# Altium schematic sheet ETH_SWITCH.SchDoc
size 594 x 420 mm; PageSetup: Record=PageOptions|CenterHorizontal=True|CenterVertical=True|PrintScale=0.94|XCorrection=1.00|YCorrection=1.00|PrintKind=1|BorderSize=5000000|LeftOffset=0|BottomOffset=0|Orientation=1|PaperLength=1000|PaperWidth=1000|Scale=100|PaperSource=7|PrintQuality=-4|MediaType=1|DitherType=10|PaperKind=A4|PrintScaleMode=1; Address1: Address1; Address2: Address2; Address3: Address3; Address4: Address4; DocumentNumber: 3; SheetNumber: 3; SheetTotal: 5
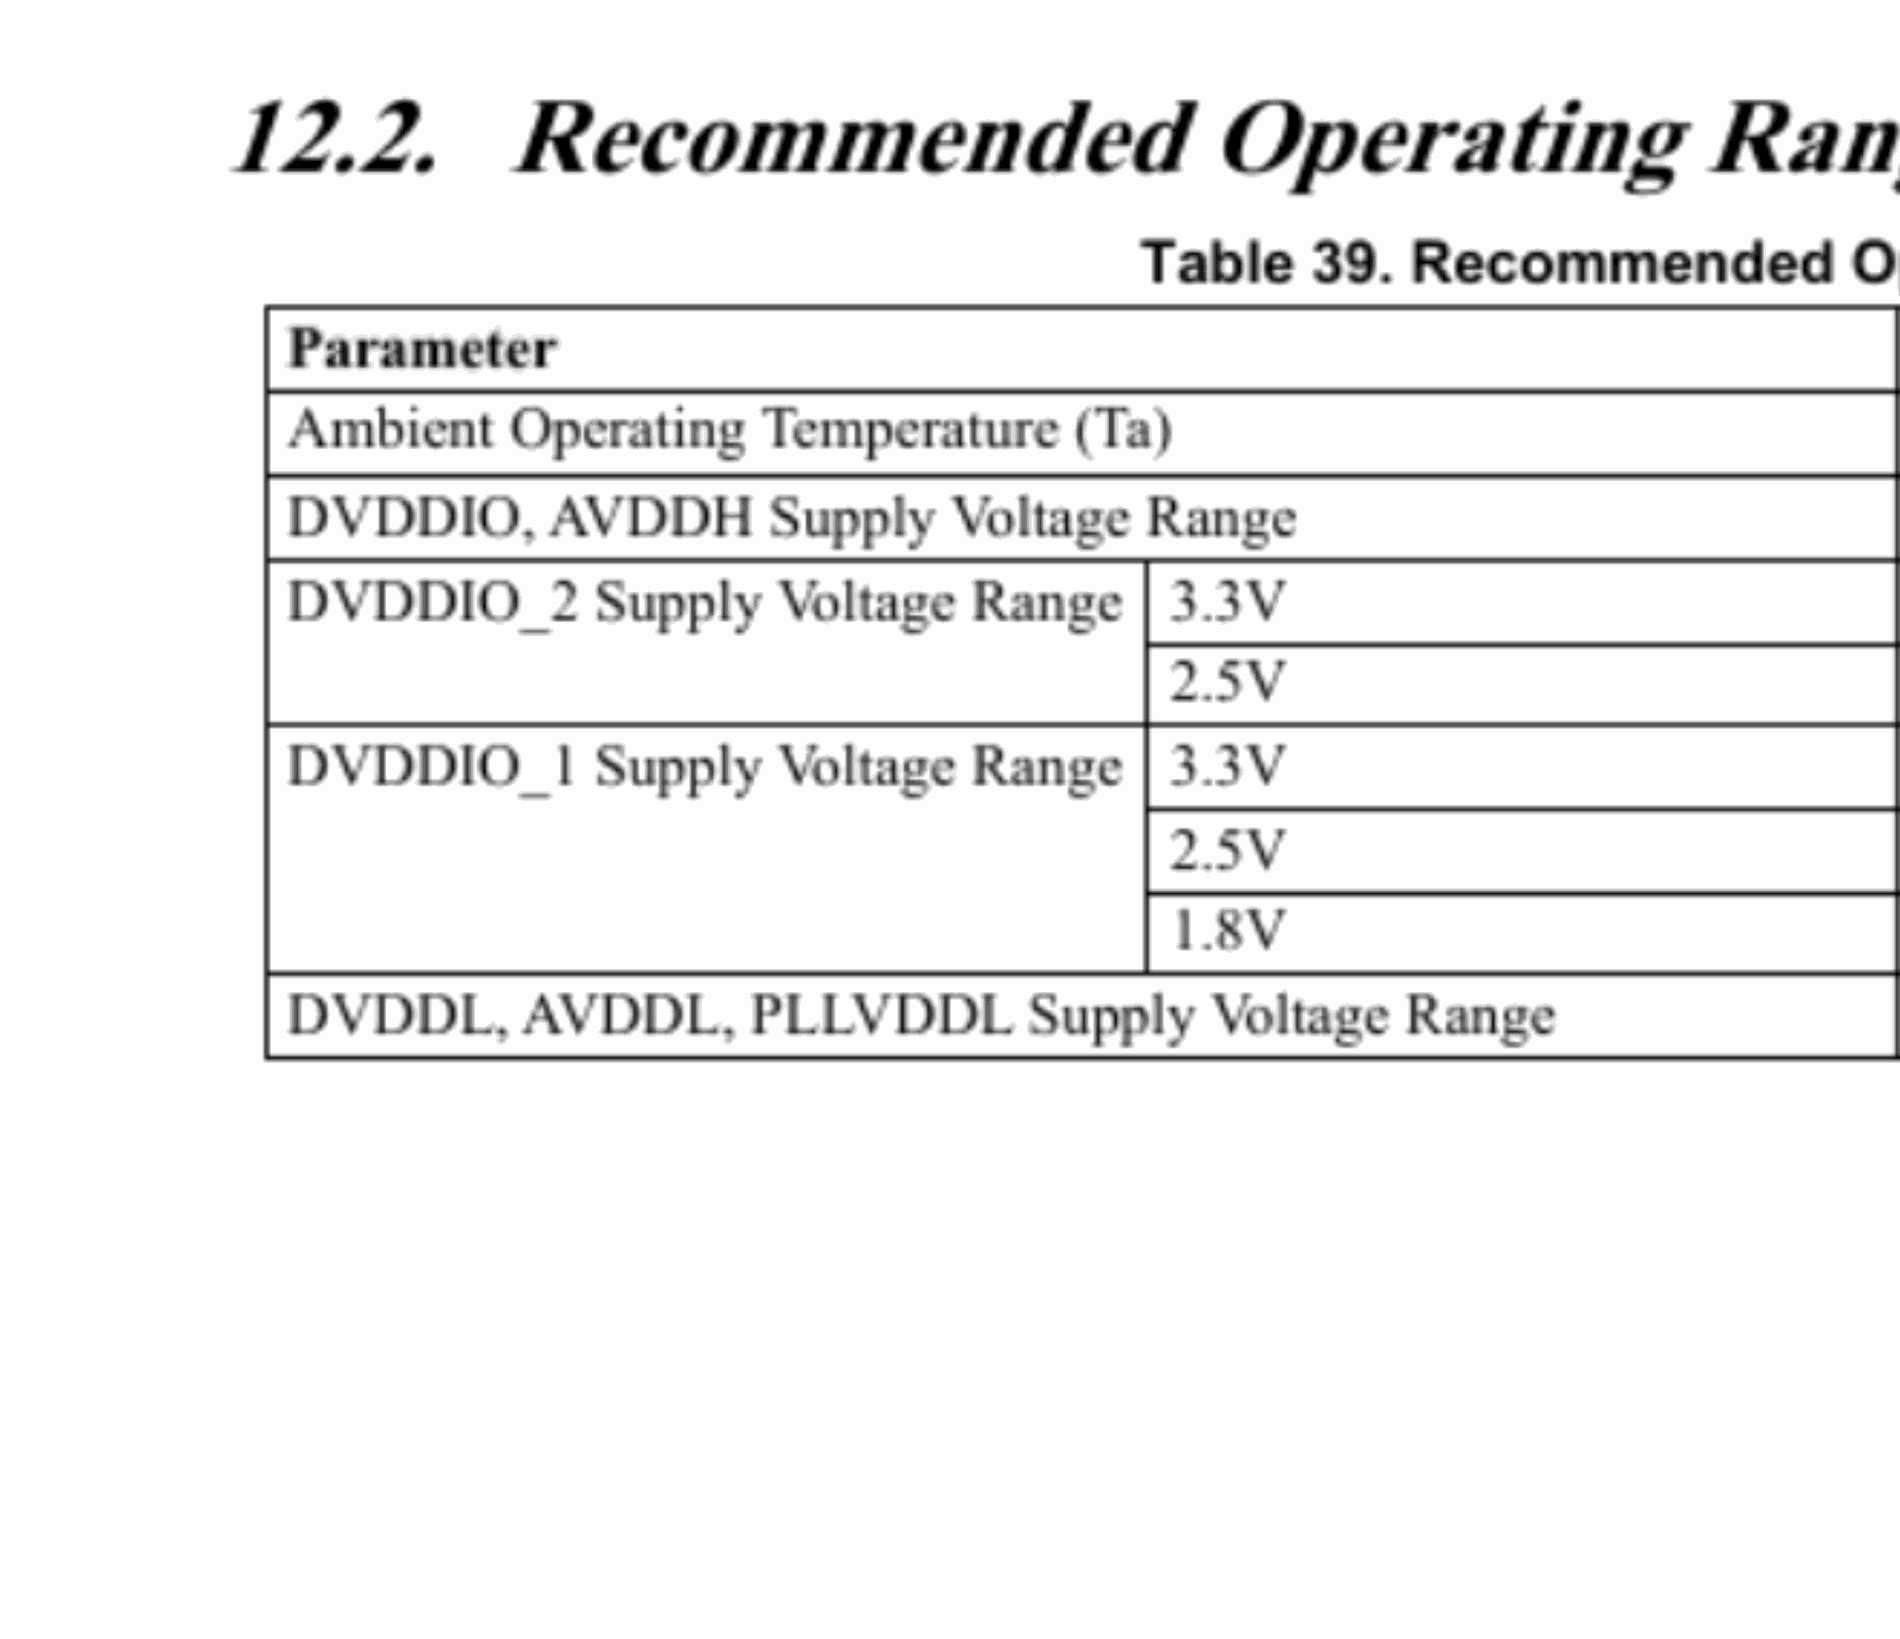
[diagram p0: ETH_SWITCH.SchDoc, top left]
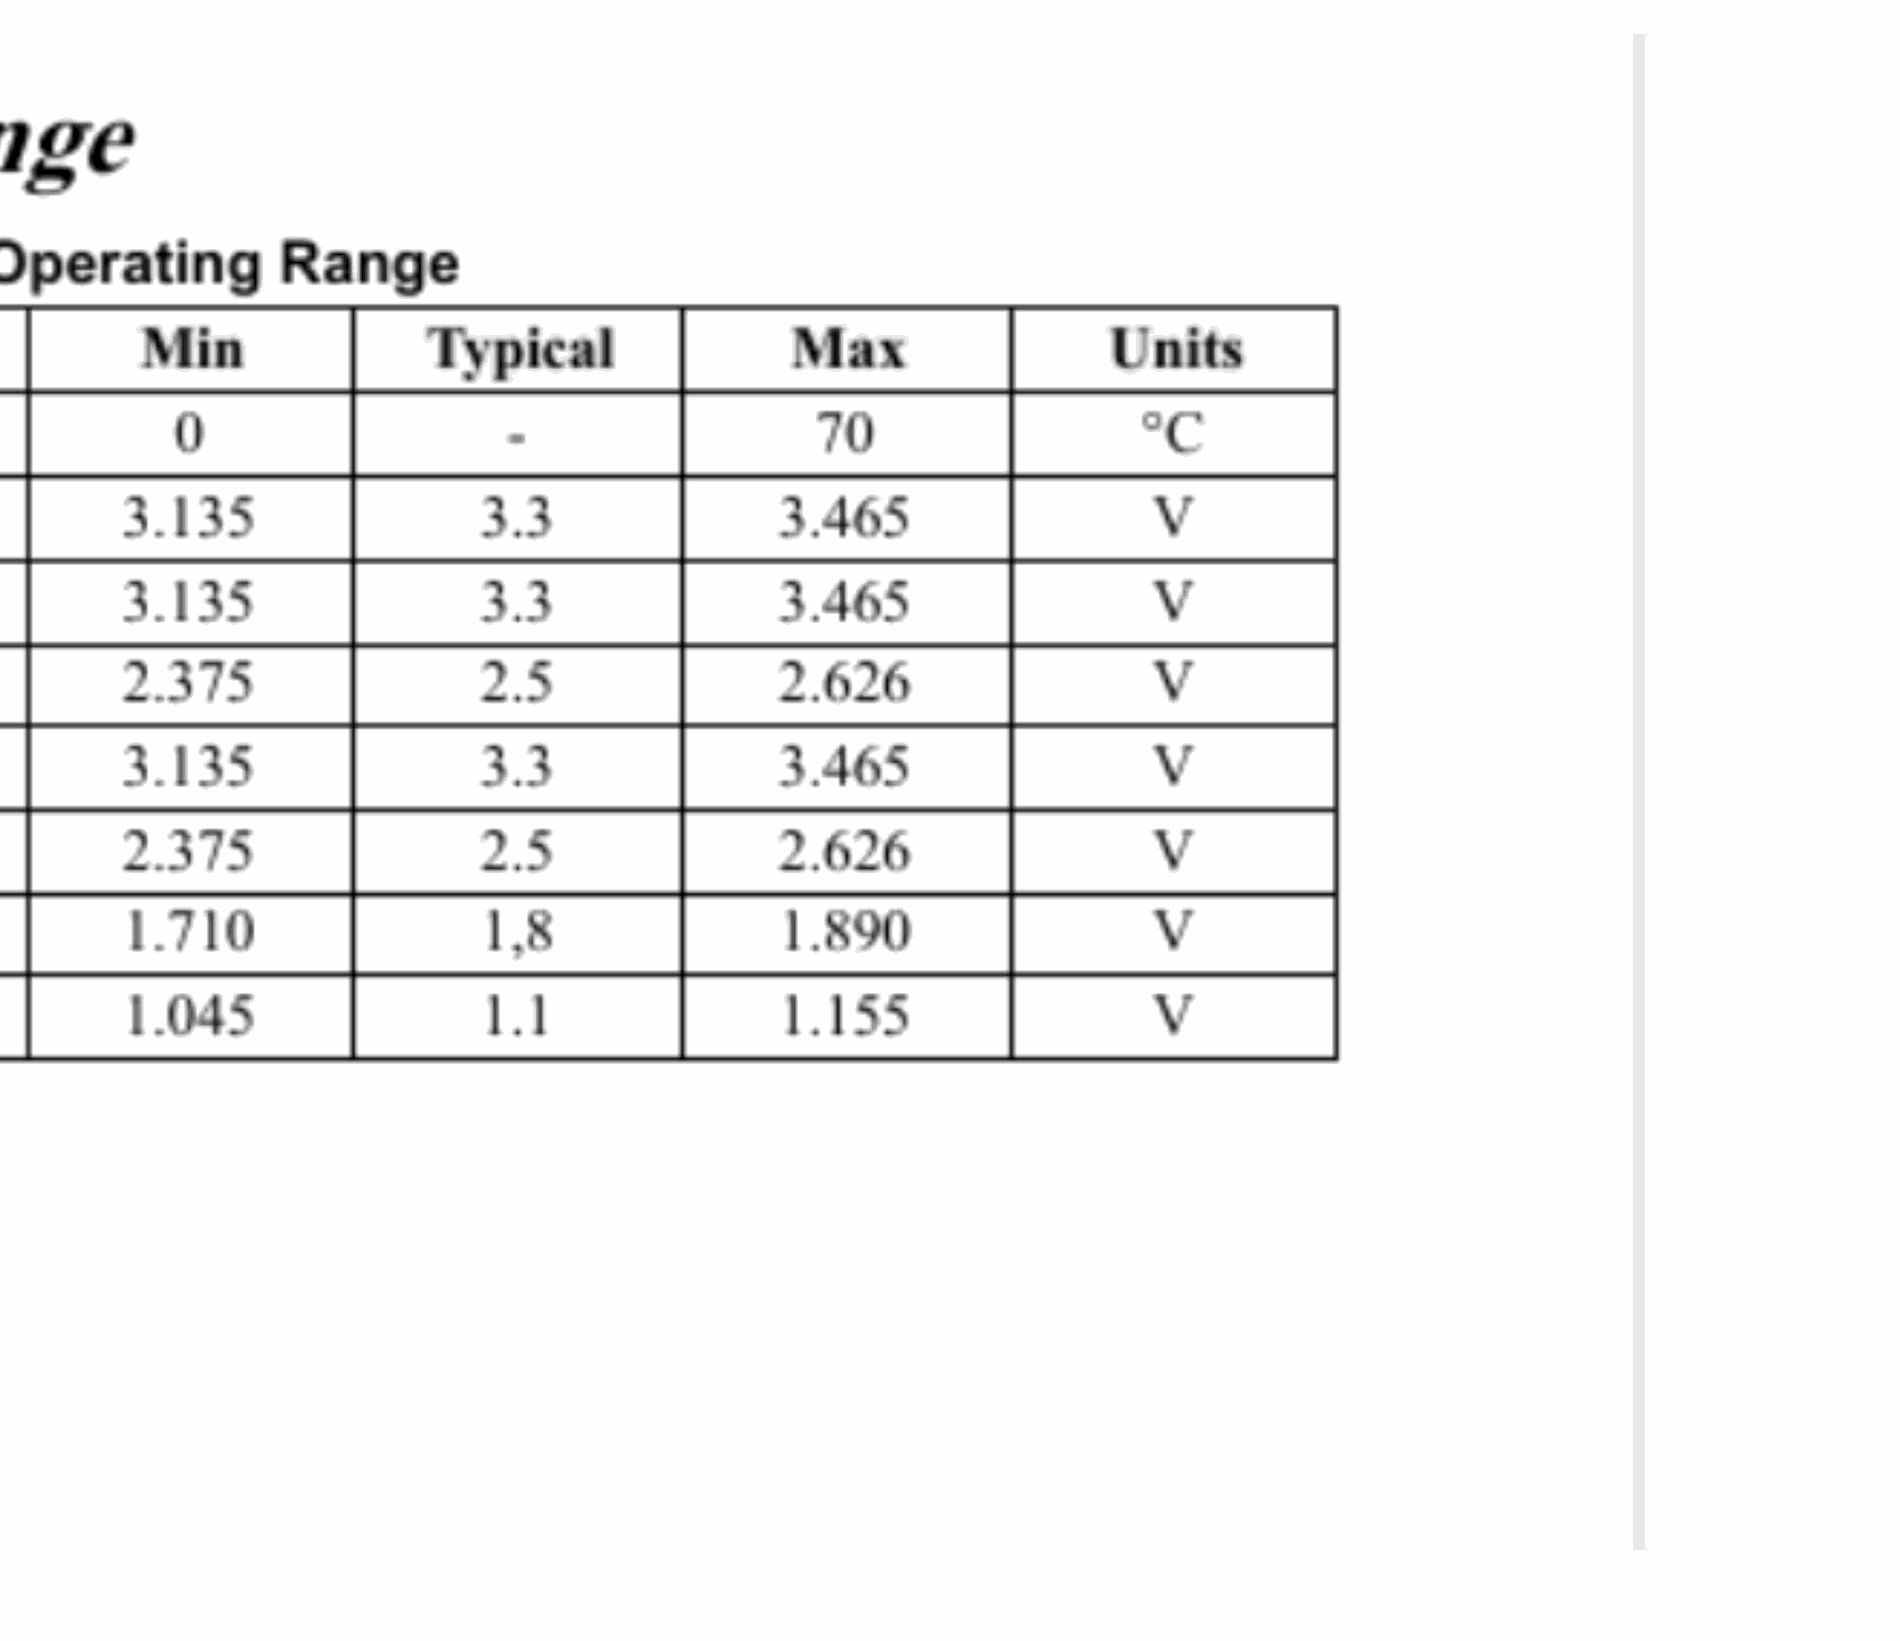
[diagram p1: ETH_SWITCH.SchDoc, top right]
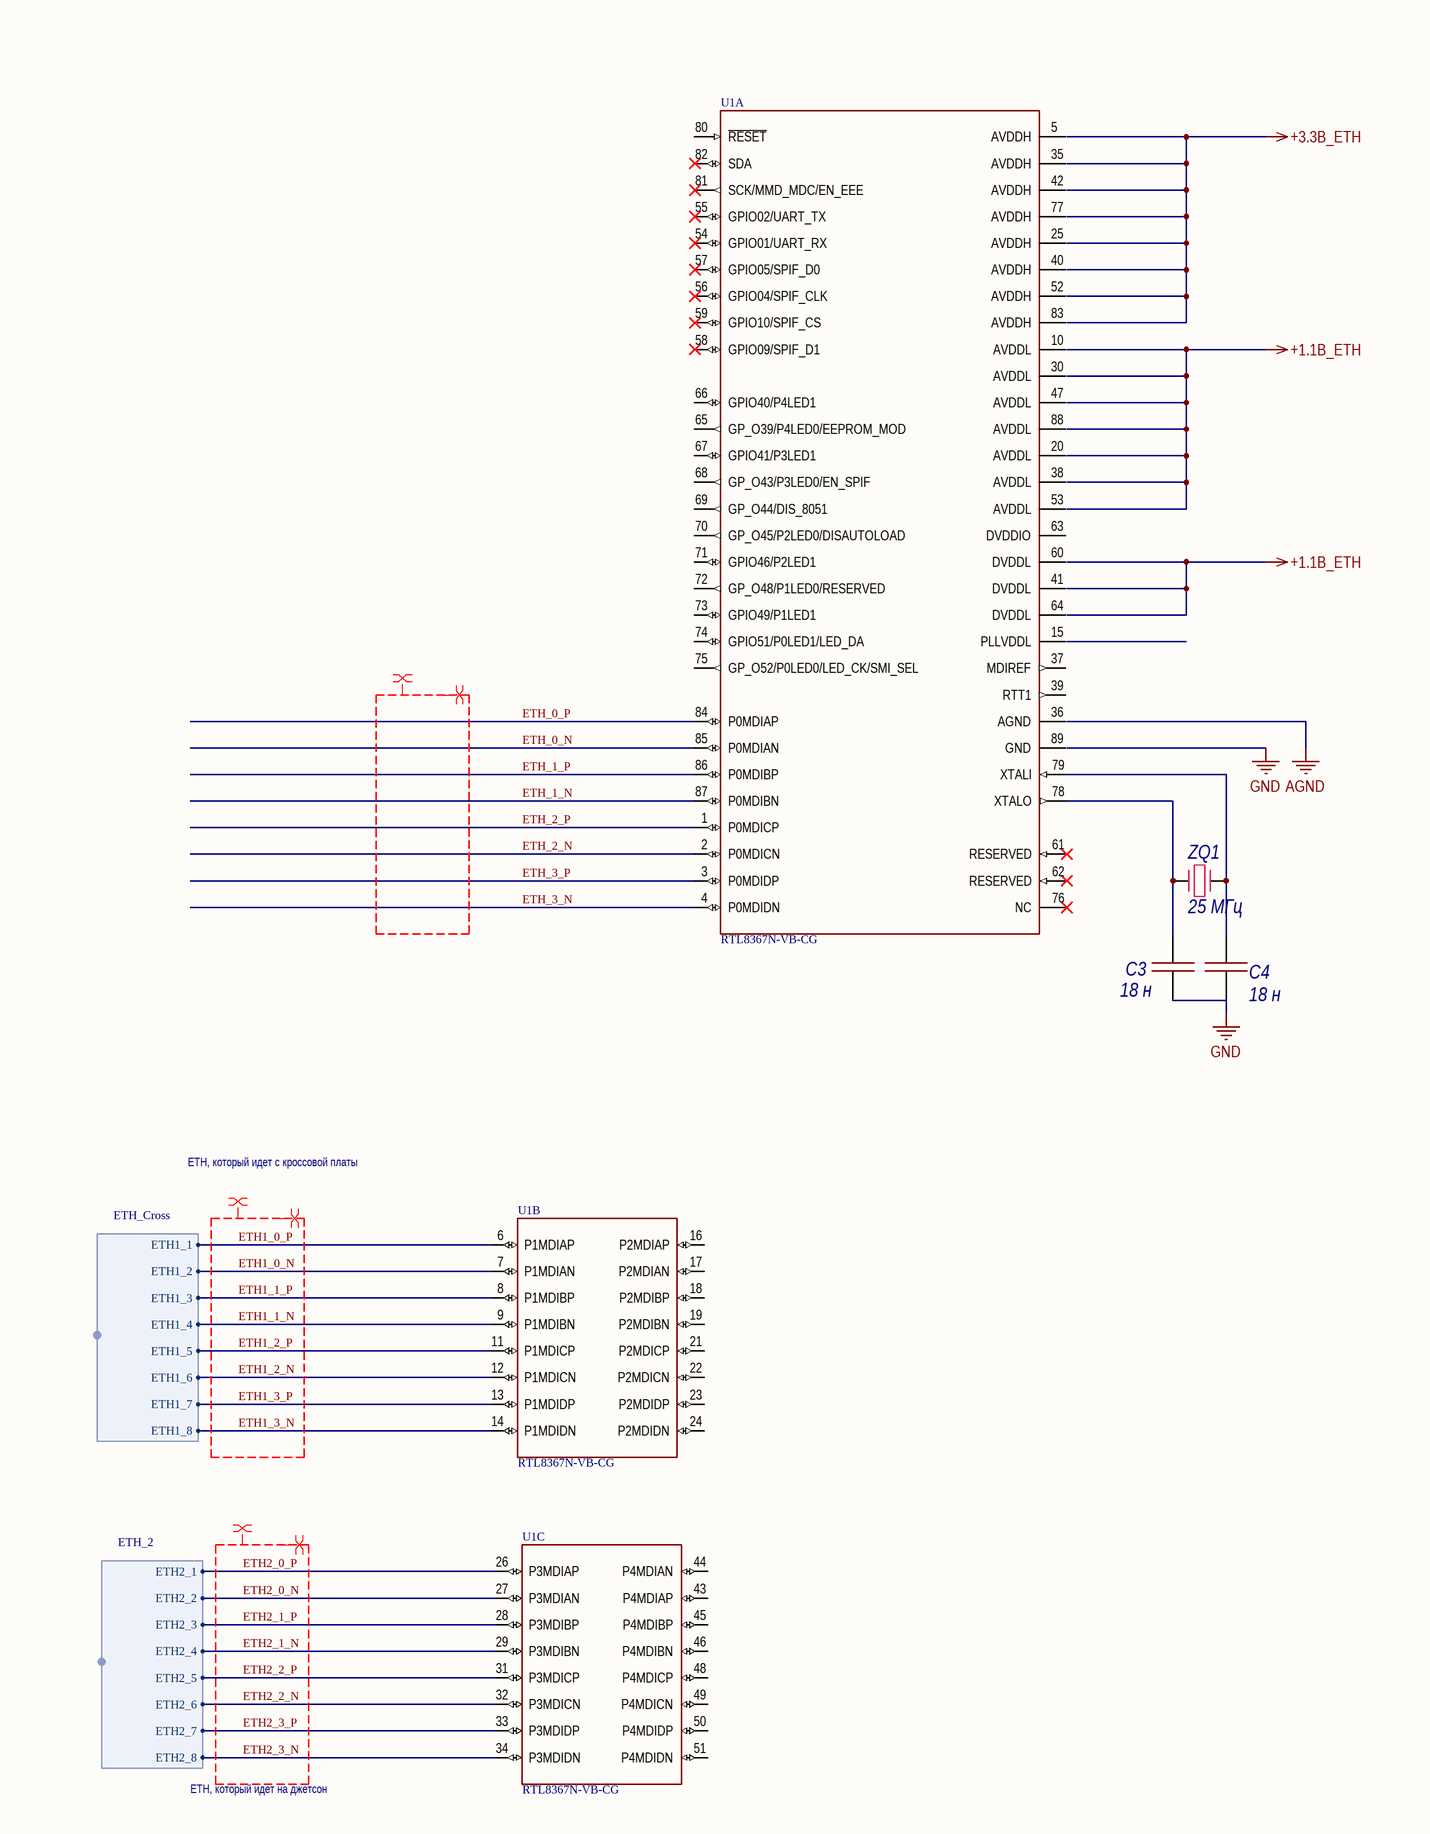
[diagram p2: ETH_SWITCH.SchDoc, bottom left]

## Parts
C3  value 18 н  [0603C]  (hidden comment: Capacitor)
C4  value 18 н  [0603C]  (hidden comment: Capacitor)
U1  RTL8367N-VB-CG  [QFN40]  (parts A,B,C of 3)
ZQ1  value 25 МГц  [HC49SD]  (hidden comment: XTAL)

## Harnesses
ETH_Cross: ETH1_1, ETH1_2, ETH1_3, ETH1_4, ETH1_5, ETH1_6, ETH1_7, ETH1_8
ETH_2: ETH2_1, ETH2_2, ETH2_3, ETH2_4, ETH2_5, ETH2_6, ETH2_7, ETH2_8

## Nets
GND: C3.1 C4.2
ETH1_0_N: U1.7(P1MDIAN) ; harness ETH_Cross.ETH1_2
ETH1_0_P: U1.6(P1MDIAP) ; harness ETH_Cross.ETH1_1
ETH1_1_N: U1.9(P1MDIBN) ; harness ETH_Cross.ETH1_4
ETH1_1_P: U1.8(P1MDIBP) ; harness ETH_Cross.ETH1_3
ETH1_2_N: U1.12(P1MDICN) ; harness ETH_Cross.ETH1_6
ETH1_2_P: U1.11(P1MDICP) ; harness ETH_Cross.ETH1_5
ETH1_3_N: U1.14(P1MDIDN) ; harness ETH_Cross.ETH1_8
ETH1_3_P: U1.13(P1MDIDP) ; harness ETH_Cross.ETH1_7
ETH2_0_N: U1.27(P3MDIAN) ; harness ETH_2.ETH2_2
ETH2_0_P: U1.26(P3MDIAP) ; harness ETH_2.ETH2_1
ETH2_1_N: U1.29(P3MDIBN) ; harness ETH_2.ETH2_4
ETH2_1_P: U1.28(P3MDIBP) ; harness ETH_2.ETH2_3
ETH2_2_N: U1.32(P3MDICN) ; harness ETH_2.ETH2_6
ETH2_2_P: U1.31(P3MDICP) ; harness ETH_2.ETH2_5
ETH2_3_N: U1.34(P3MDIDN) ; harness ETH_2.ETH2_8
ETH2_3_P: U1.33(P3MDIDP) ; harness ETH_2.ETH2_7
ETH_0_N: U1.85(P0MDIAN)
ETH_0_P: U1.84(P0MDIAP)
ETH_1_N: U1.87(P0MDIBN)
ETH_1_P: U1.86(P0MDIBP)
ETH_2_N: U1.2(P0MDICN)
ETH_2_P: U1.1(P0MDICP)
ETH_3_N: U1.4(P0MDIDN)
ETH_3_P: U1.3(P0MDIDP)
NetC3_2: C3.2 U1.78(XTALO) ZQ1.1
NetC4_1: C4.1 U1.79(XTALI) ZQ1.2

Not connected (* = marked no-connect by the designer): U1 5(AVDDH) 10(AVDDL) 15(PLLVDDL) 16(P2MDIAP) 17(P2MDIAN) 18(P2MDIBP) 19(P2MDIBN) 20(AVDDL) 21(P2MDICP) 22(P2MDICN) 23(P2MDIDP) 24(P2MDIDN) 25(AVDDH) 30(AVDDL) 35(AVDDH) 36(AGND) 37(MDIREF) 38(AVDDL) 39(RTT1) 40(AVDDH) 41(DVDDL) 42(AVDDH) 43(P4MDIAP) 44(P4MDIAN) 45(P4MDIBP) 46(P4MDIBN) 47(AVDDL) 48(P4MDICP) 49(P4MDICN) 50(P4MDIDP) 51(P4MDIDN) 52(AVDDH) 53(AVDDL) 54(GPIO01/UART_RX) 55(GPIO02/UART_TX) 56(GPIO04/SPIF_CLK) 57(GPIO05/SPIF_D0) 58(GPIO09/SPIF_D1) 59(GPIO10/SPIF_CS) 60(DVDDL) 61(RESERVED)* 62(RESERVED)* 63(DVDDIO) 64(DVDDL) 65(GP_O39/P4LED0/EEPROM_MOD) 66(GPIO40/P4LED1) 67(GPIO41/P3LED1) 68(GP_O43/P3LED0/EN_SPIF) 69(GP_O44/DIS_8051) 70(GP_O45/P2LED0/DISAUTOLOAD) 71(GPIO46/P2LED1) 72(GP_O48/P1LED0/RESERVED) 73(GPIO49/P1LED1) 74(GPIO51/P0LED1/LED_DA) 75(GP_O52/P0LED0/LED_CK/SMI_SEL) 76(NC)* 77(AVDDH) 80(~{RESET}) 81(SCK/MMD_MDC/EN_EEE) 82(SDA) 83(AVDDH) 88(AVDDL) 89(GND)

## Layout directives
differential pair: (no net found under the mark), ETH1_0_N, ETH1_0_P, ETH1_1_N, ETH1_1_P, ETH1_2_N, ETH1_2_P, ETH1_3_N, ETH1_3_P, ETH2_0_N, ETH2_0_P, ETH2_1_N, ETH2_1_P, ETH2_2_N, ETH2_2_P, ETH2_3_N, ETH2_3_P
Impedance: 100 Ohm; net class Ethernet: (no net found under the mark), ETH1_0_N, ETH1_0_P, ETH1_1_N, ETH1_1_P, ETH1_2_N, ETH1_2_P, ETH1_3_N, ETH1_3_P, ETH2_0_N, ETH2_0_P, ETH2_1_N, ETH2_1_P, ETH2_2_N, ETH2_2_P, ETH2_3_N, ETH2_3_P

## Notes on the sheet
- ETH, который идет с кроссовой платы
- ETH, который идет на джетсон
- Перв. примен.
- Справ. №
- Подп. и дата
- Инв. № дубл.
- Взам. инв. №
- Инв. № подл.
- Изм.
- Лист
- № докум.
- Подп.
- Дата
- Копировал
- Формат А2

## Library data of the parts
C3 C4 = Capacitor_18n_10_50V_X7R_0603C: Конденсатор; Tolerance: 0,1; Voltage (V): 50; Dielectric: X7R; Capacity (nF): 18; Part Number: Capacitor_18n_10_50V_X7R_0603C
U1 = RTL8367N-VB-CG: MF: Realtek; Package: None; Price: None; Value: *; MP: RTL8367N-VB-CG; Availability: Unavailable; Part Number: RTL8367N-VB-CG
ZQ1 = XTAL: Кварцевый резонатор; Part Number: XTAL